# Altium schematic sheet Option_PMIC_RK816.SchDoc
size 297 x 209 mm
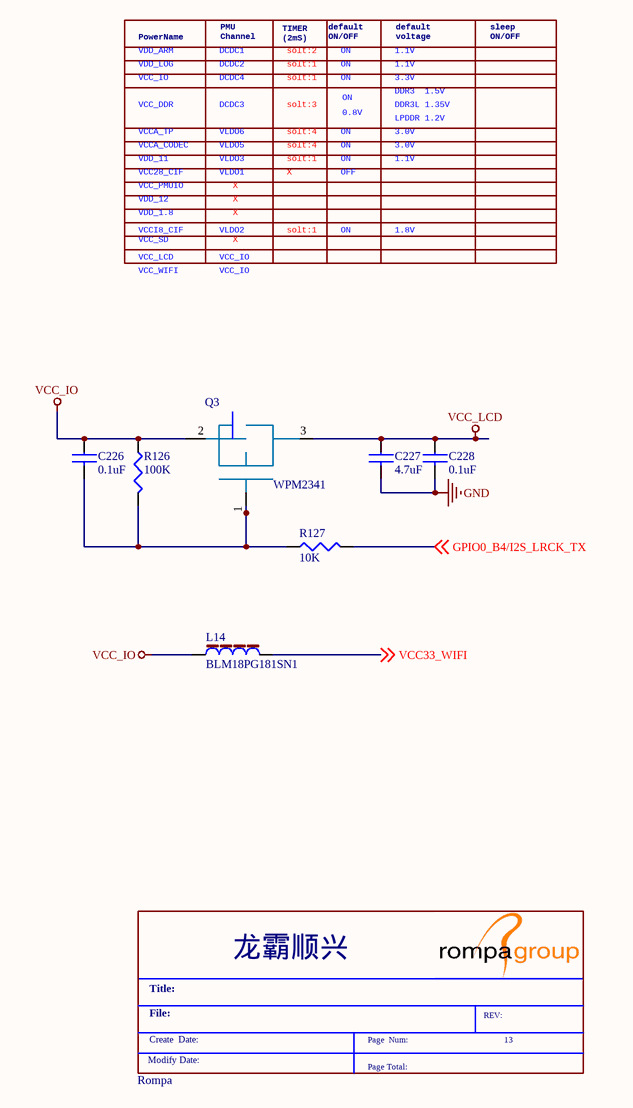
[diagram p0: Option_PMIC_RK816.SchDoc]

## Parts
*  Rompa  Schematic Page Number: 13  (graphical)
C226  0.1uF  [C0402]
C227  4.7uF  [C0402]
C228  0.1uF  [C0402]
L14  BLM18PG181SN1  [L0603]
Q3  WPM2341  [SOT23]
R126  100K  [R0402]
R127  10K  [R0402]

## Nets
GND: C227.2 C228.2
VCC_IO: C226.1 L14.1 R126.1
VCC_LCD: C227.1 C228.1
GPIO0_B4/I2S_LRCK_TX: R127.2 ; off-sheet GPIO0_B4/I2S_LRCK_TX
VCC33_WIFI: L14.2 ; off-sheet VCC33_WIFI
NetC226_2: C226.2 Q3.1 R126.2 R127.1

Not connected (* = marked no-connect by the designer): Q3 2 3

## Notes on the sheet
- VDD_ARM
- VCC_IO
- PowerName
- VDD_LOG
- DCDC4
- PMU
  Channel
- DCDC2
- DCDC1
- TIMER
  (2mS)
- solt:1
- solt:2
- default
  ON/OFF
- ON
- default
  voltage
- 1.1V
- DDR3  1.5V
- 3.3V
- sleep
  ON/OFF
- VCC_DDR
- VDD_11
- VCCA_TP
- VCCA_CODEC
- DCDC3
- VLDO3
- VLDO5
- VLDO6
- solt:3
- solt:4
- 0.8V
- 3.0V
- LPDDR 1.2V
- DDR3L 1.35V
- VCCI8_CIF
- VCC28_CIF
- VCC_PMUIO
- VDD_12
- VDD_1.8
- VLDO1
- VLDO2
- X
- OFF
- 1.8V
- VCC_LCD
- VCC_SD
- VCC_WIFI
- (in symbol Rompa) 龙霸顺兴; Title:; File:; REV:; Create  Date:; Page  Num:; Modify Date:; Page Total:

## Library data of the parts
C226-C228 = CAP NP
L14 = INDUCTOR_2
R126 R127 = RESISTOR